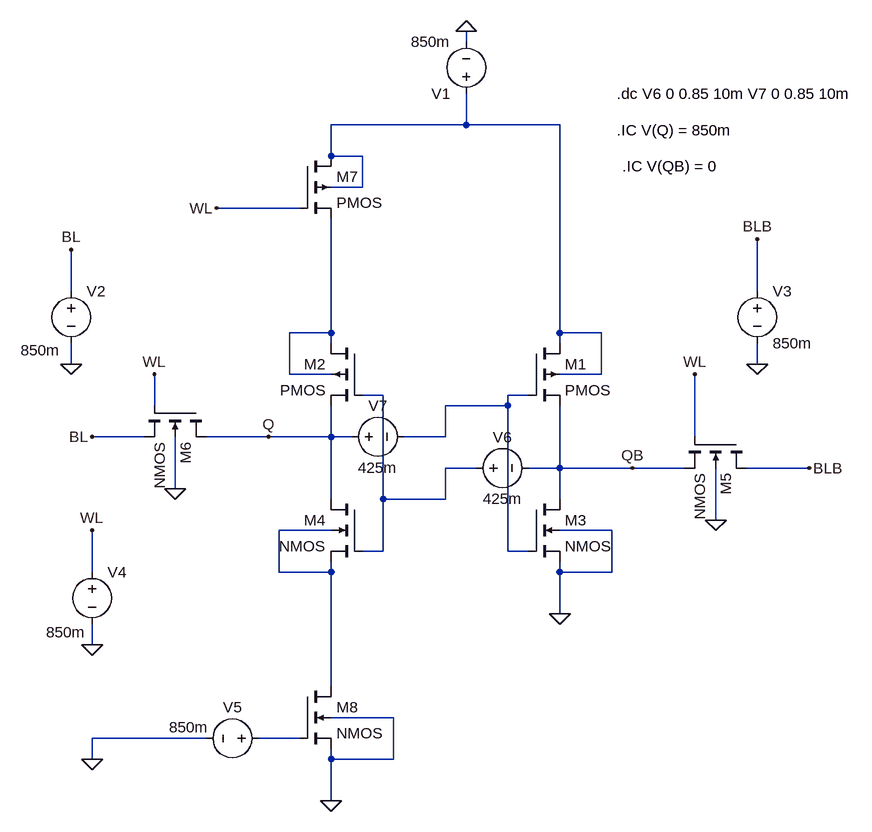
[diagram p0: schematic sram8t_snm.asc]
sram8t_snm.asc, the LTspice schematic file:
Version 4
SHEET 1 1636 4844
WIRE 224 -400 224 -416
WIRE 224 -272 224 -320
WIRE 224 -272 16 -272
WIRE 368 -272 224 -272
WIRE 16 -224 16 -272
WIRE 64 -224 16 -224
WIRE 64 -176 64 -224
WIRE 64 -176 16 -176
WIRE -32 -144 -160 -144
WIRE -384 -16 -384 -80
WIRE 672 -16 672 -96
WIRE 16 48 16 -128
WIRE 16 48 -48 48
WIRE 368 48 368 -272
WIRE 432 48 368 48
WIRE 16 64 16 48
WIRE 368 64 368 48
WIRE -384 96 -384 64
WIRE 672 96 672 64
WIRE -48 112 -48 48
WIRE 16 112 -48 112
WIRE 432 112 432 48
WIRE 432 112 368 112
WIRE 96 144 64 144
WIRE 320 144 288 144
WIRE -256 160 -256 112
WIRE 288 160 288 144
WIRE 288 160 192 160
WIRE -272 208 -352 208
WIRE -80 208 -176 208
WIRE 16 208 16 160
WIRE 16 208 -80 208
WIRE 48 208 16 208
WIRE 192 208 192 160
WIRE 192 208 128 208
WIRE 576 208 576 112
WIRE 240 256 192 256
WIRE 368 256 368 160
WIRE 368 256 320 256
WIRE 480 256 368 256
WIRE 560 256 480 256
WIRE 752 256 656 256
WIRE -224 288 -224 208
WIRE 16 304 16 208
WIRE 96 304 96 144
WIRE 192 304 192 256
WIRE 192 304 96 304
WIRE 368 304 368 256
WIRE 608 336 608 256
WIRE 16 352 -64 352
WIRE 448 352 368 352
WIRE 96 384 96 304
WIRE 96 384 64 384
WIRE 288 384 288 160
WIRE 320 384 288 384
WIRE -352 416 -352 352
WIRE -64 416 -64 352
WIRE 16 416 16 400
WIRE 16 416 -64 416
WIRE 368 416 368 400
WIRE 448 416 448 352
WIRE 448 416 368 416
WIRE 368 480 368 416
WIRE -352 528 -352 496
WIRE 16 592 16 416
WIRE 112 640 16 640
WIRE -176 672 -352 672
WIRE -32 672 -96 672
WIRE -352 704 -352 672
WIRE 16 704 16 688
WIRE 112 704 112 640
WIRE 112 704 16 704
WIRE 16 768 16 704
FLAG -224 288 0
FLAG 608 336 0
FLAG 224 -416 0
FLAG -384 96 0
FLAG -352 528 0
FLAG 672 96 0
FLAG -80 208 Q
FLAG 480 256 QB
FLAG 576 112 WL
FLAG -256 112 WL
FLAG 752 256 BLB
FLAG -352 208 BL
FLAG -352 352 WL
FLAG -384 -80 BL
FLAG 672 -96 BLB
FLAG -160 -144 WL
FLAG 368 480 0
FLAG 16 768 0
FLAG -352 704 0
SYMBOL pmos4 320 64 R0
SYMATTR InstName M1
SYMATTR Value2 l=20n w=320n
SYMBOL pmos4 64 64 M0
SYMATTR InstName M2
SYMATTR Value2 l=20n w=320n
SYMBOL nmos4 320 304 R0
SYMATTR InstName M3
SYMATTR Value2 l=20n w=960n
SYMBOL nmos4 64 304 M0
SYMATTR InstName M4
SYMATTR Value2 l=20n w=960n
SYMBOL nmos4 656 208 R90
SYMATTR InstName M5
SYMATTR Value2 l=20n w=128n
SYMBOL nmos4 -176 160 R90
SYMATTR InstName M6
SYMATTR Value2 l=20n w=128n
SYMBOL voltage 224 -304 R180
WINDOW 123 0 0 Left 0
WINDOW 39 0 0 Left 0
SYMATTR InstName V1
SYMATTR Value 850m
SYMBOL voltage -384 -32 R0
WINDOW 3 -17 107 Right 2
WINDOW 123 0 0 Left 0
WINDOW 39 0 0 Left 0
SYMATTR Value 850m
SYMATTR InstName V2
SYMBOL voltage 672 -32 R0
WINDOW 123 0 0 Left 0
WINDOW 39 0 0 Left 0
SYMATTR InstName V3
SYMATTR Value 850m
SYMBOL voltage -352 400 R0
WINDOW 3 -10 109 Right 2
WINDOW 123 0 0 Left 0
WINDOW 39 0 0 Left 0
SYMATTR Value 850m
SYMATTR InstName V4
SYMBOL pmos4 -32 -224 R0
SYMATTR InstName M7
SYMBOL nmos4 -32 592 R0
SYMATTR InstName M8
SYMBOL voltage -80 672 R90
WINDOW 0 -32 56 VBottom 2
WINDOW 3 -33 123 VTop 2
WINDOW 123 0 0 Left 0
WINDOW 39 0 0 Left 0
SYMATTR InstName V5
SYMATTR Value 850m
SYMBOL voltage 32 208 R270
WINDOW 0 32 56 VTop 2
WINDOW 3 -32 56 VBottom 2
WINDOW 123 0 0 Left 0
WINDOW 39 0 0 Left 0
SYMATTR InstName V7
SYMATTR Value 425m
SYMBOL voltage 224 256 R270
WINDOW 0 32 56 VTop 2
WINDOW 3 -32 56 VBottom 2
WINDOW 123 0 0 Left 0
WINDOW 39 0 0 Left 0
SYMATTR InstName V6
SYMATTR Value 425m
TEXT 456 -320 Left 2 !.dc V6 0 0.85 10m V7 0 0.85 10m
TEXT 456 -264 Left 2 !.IC V(Q) = 850m
TEXT 464 -208 Left 2 !.IC V(QB) = 0

The netlist it stands for:
* sram8t_snm.asc
M1 N001 N004 QB N001 PMOS l=20n w=320n
M2 N002 N003 Q N002 PMOS l=20n w=320n
M3 QB N004 0 0 NMOS l=20n w=960n
M4 Q N003 N005 N005 NMOS l=20n w=960n
M5 BLB WL QB 0 NMOS l=20n w=128n
M6 Q WL BL 0 NMOS l=20n w=128n
V1 N001 0 850m
V2 BL 0 850m
V3 BLB 0 850m
V4 WL 0 850m
M7 N001 WL N002 N001 PMOS
M8 N005 N006 0 0 NMOS
V5 N006 0 850m
V7 Q N004 425m
V6 N003 QB 425m
.model NMOS NMOS
.model PMOS PMOS
.lib standard.mos
.dc V6 0 0.85 10m V7 0 0.85 10m
.IC V(Q) = 850m
.IC V(QB) = 0
.backanno
.end

* Results of the author's LTspice run, read from the files saved beside the schematic
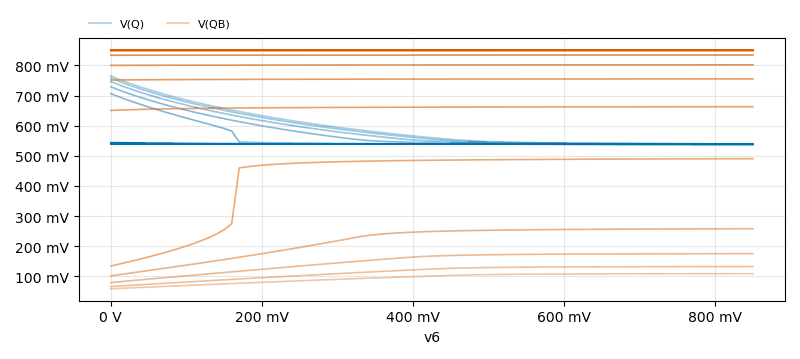
[diagram p1: DC transfer characteristic of sram8t_snm.asc, plotted from the saved traces]
* DC transfer characteristic, 86 runs:
*   V(Q) [run 1]: 765.3 mV at v6=0 V, 539.6 mV at v6=850 mV, min 539.6 mV, max 765.3 mV
*   V(Q) [run 2]: 758.4 mV at v6=0 V, 539.5 mV at v6=850 mV, min 539.5 mV, max 758.4 mV
*   V(Q) [run 3]: 746.5 mV at v6=0 V, 539.3 mV at v6=850 mV, min 539.3 mV, max 746.5 mV
*   V(Q) [run 4]: 728.9 mV at v6=0 V, 539.1 mV at v6=850 mV, min 539.1 mV, max 728.9 mV
*   V(Q) [run 5]: 706.4 mV at v6=0 V, 538.6 mV at v6=850 mV, min 538.6 mV, max 706.4 mV
*   V(Q) [run 6]: 544.4 mV at v6=0 V, 538.4 mV at v6=850 mV, min 538.4 mV, max 544.4 mV
*   V(Q) [run 7]: 541.5 mV at v6=0 V, 538.4 mV at v6=850 mV, min 538.4 mV, max 541.5 mV
*   V(Q) [run 8]: 540.8 mV at v6=0 V, 538.3 mV at v6=850 mV, min 538.3 mV, max 540.8 mV
*   V(QB) [run 1]: 58.38 mV at v6=0 V, 108.6 mV at v6=850 mV, min 58.38 mV, max 108.6 mV
*   V(QB) [run 2]: 65.66 mV at v6=0 V, 132.3 mV at v6=850 mV, min 65.66 mV, max 132.3 mV
*   V(QB) [run 3]: 79.09 mV at v6=0 V, 175.1 mV at v6=850 mV, min 79.09 mV, max 175.1 mV
*   V(QB) [run 4]: 101.3 mV at v6=0 V, 257.9 mV at v6=850 mV, min 101.3 mV, max 257.9 mV
*   V(QB) [run 5]: 134.1 mV at v6=0 V, 490.4 mV at v6=850 mV, min 134.1 mV, max 490.4 mV
*   V(QB) [run 6]: 650.5 mV at v6=0 V, 662.9 mV at v6=850 mV, min 650.5 mV, max 662.9 mV
*   V(QB) [run 7]: 751.6 mV at v6=0 V, 755.3 mV at v6=850 mV, min 751.6 mV, max 755.3 mV
*   V(QB) [run 8]: 800.1 mV at v6=0 V, 802 mV at v6=850 mV, min 800.1 mV, max 802 mV